# EasyEDA schematic SCH_ESP32-S3-DevKitC-1_2026-10-10.json
TITLE: ESP32-S3-WROOM-1; REV: v1.1; Date: 2022-12-12; Sheet: 1/1; Drawn By: zobject; Company: zObject
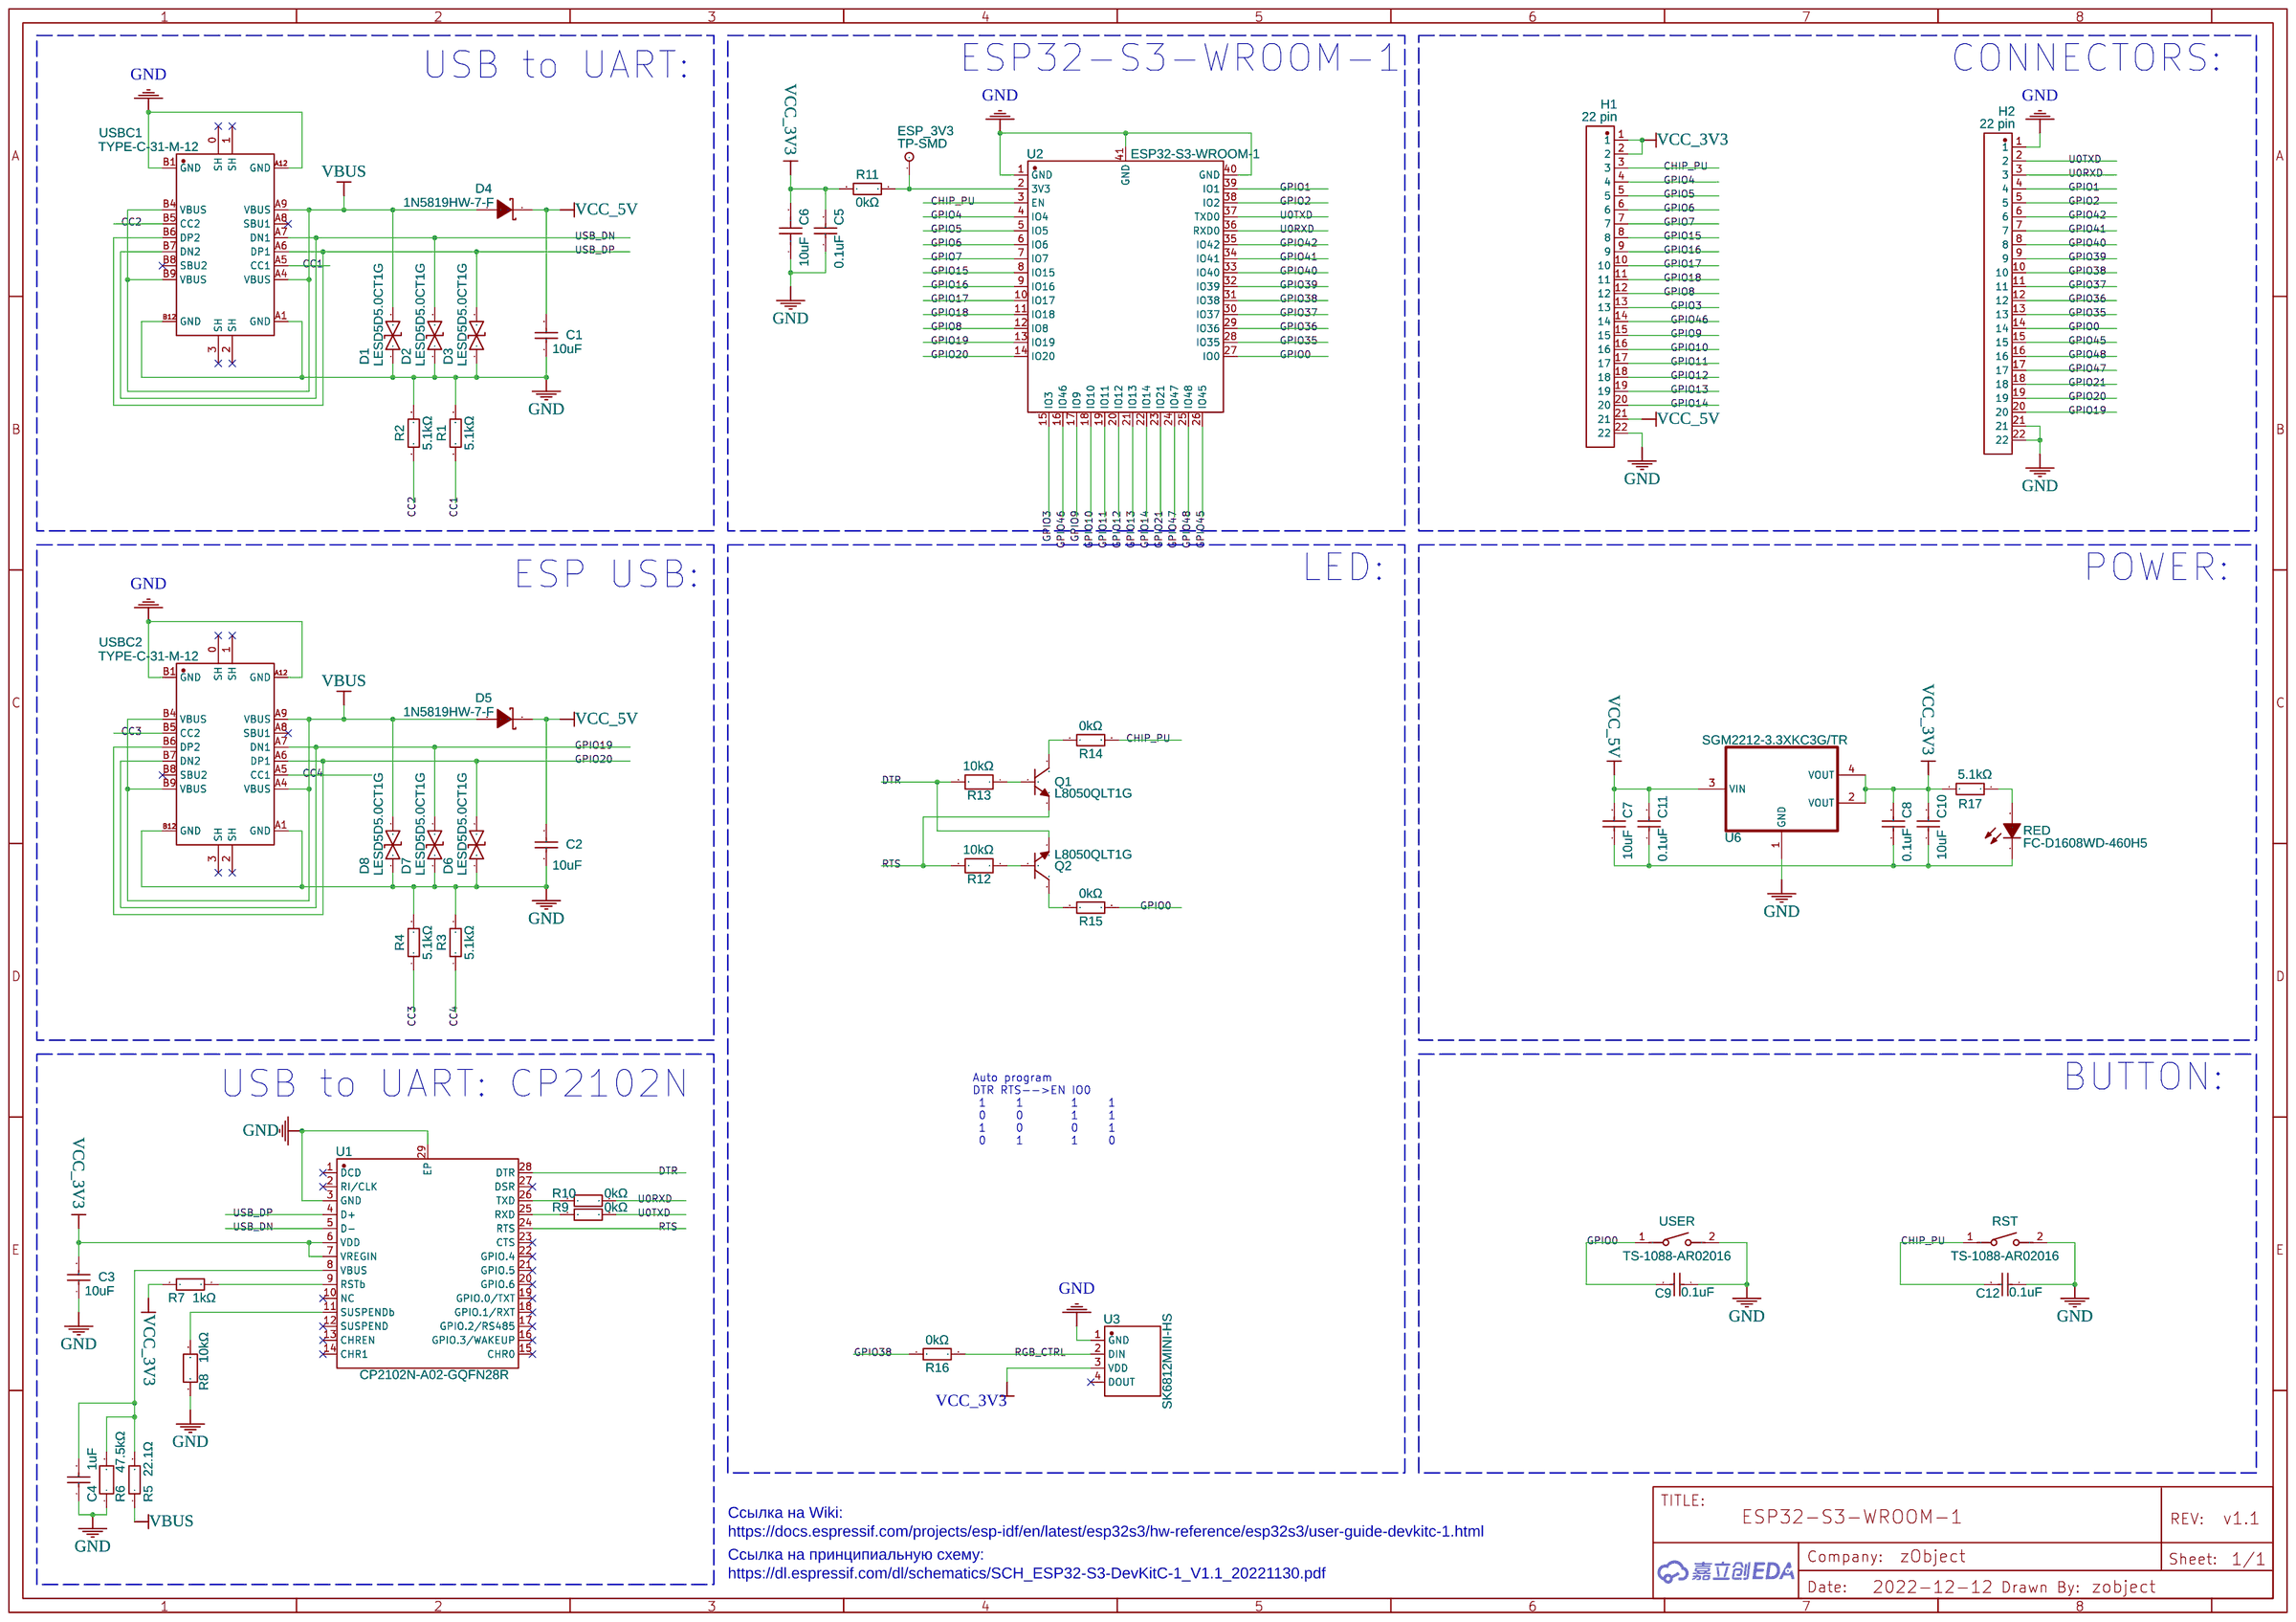
[diagram p0: schematic sheet]

## Parts
C1  10uF  [C0603]
C2  10uF  [C0603]
C3  10uF  [C0603]
C4  1uF  [C0603]
C5  0.1uF  [C0603]
C6  10uF  [C0603]
C7  10uF  [C0603]
C8  0.1uF  [C0603]
C9  0.1uF  [C0603]
C10  10uF  [C0603]
C11  0.1uF  [C0603]
C12  0.1uF  [C0603]
D1  LESD5D5.0CT1G  [SOD-523_L1.2-W0.8-LS1.6-BI]
D2  LESD5D5.0CT1G  [SOD-523_L1.2-W0.8-LS1.6-BI]
D3  LESD5D5.0CT1G  [SOD-523_L1.2-W0.8-LS1.6-BI]
D4  1N5819HW-7-F  [SOD-123_L2.8-W1.8-LS3.7-FD]
D5  1N5819HW-7-F  [SOD-123_L2.8-W1.8-LS3.7-FD]
D6  LESD5D5.0CT1G  [SOD-523_L1.2-W0.8-LS1.6-BI]
D7  LESD5D5.0CT1G  [SOD-523_L1.2-W0.8-LS1.6-BI]
D8  LESD5D5.0CT1G  [SOD-523_L1.2-W0.8-LS1.6-BI]
ESP_3V3  TP-SMD  [TP-SMD]
H1  22 pin  [HDR-TH_22P-P2.54-V-F]
H2  22 pin  [HDR-TH_22P-P2.54-V-F]
Q1  L8050QLT1G  [SOT-23-3_L2.9-W1.3-P1.90-LS2.4-BR]
Q2  L8050QLT1G  [SOT-23-3_L2.9-W1.3-P1.90-LS2.4-BR]
R1  5.1kΩ  [R0603]
R2  5.1kΩ  [R0603]
R3  5.1kΩ  [R0603]
R4  5.1kΩ  [R0603]
R5  22.1Ω  [R0603]
R6  47.5kΩ  [R0603]
R7  1kΩ  [R0603]
R8  10kΩ  [R0603]
R9  0kΩ  [R0603]
R10  0kΩ  [R0603]
R11  0kΩ  [R0603]
R12  10kΩ  [R0603]
R13  10kΩ  [R0603]
R14  0kΩ  [R0603]
R15  0kΩ  [R0603]
R16  0kΩ  [R0603]
R17  5.1kΩ  [R0603]
RED  FC-D1608WD-460H5  [LED0603-RD]
RST  TS-1088-AR02016  [SW-SMD_L4.0-W2.9-LS5.0]
U1  CP2102N-A02-GQFN28R  [QFN-28_L5.0-W5.0-P0.50-TL-EP3.3]
U2  ESP32-S3-WROOM-1  [WIRELM-SMD_ESP32-S3-WROOM-1]
U3  SK6812MINI-HS  [LED-SMD_4P-L3.5-W3.5-BR_SK6812MINI-HS]
U6  SGM2212-3.3XKC3G/TR  [SOT-223-4_L6.5-W3.5-P2.30-LS7.0-BR]
USBC1  TYPE-C-31-M-12  [USB-C_SMD-TYPE-C-31-M-12]
USBC2  TYPE-C-31-M-12  [USB-C_SMD-TYPE-C-31-M-12]
USER  TS-1088-AR02016  [SW-SMD_L4.0-W2.9-LS5.0]

## Library data of the parts
C1-C3 C7 C10 = 0603F106M160NT: Supplier: LCSC; Manufacturer: FH; Supplier Part: C48906; JLCPCB Part Class: Extended Part
C4 = C1608X5R1C105KT000N: Supplier: LCSC; Manufacturer: TDK; Supplier Part: C76611; JLCPCB Part Class: Extended Part
C5 C8 C9 C11 C12 = 0603B104K500NT: Supplier: LCSC; Manufacturer: FH(风华); Supplier Part: C30926; JLCPCB Part Class: Extended Part
C6 = LMK107BJ106MALTD: Supplier: LCSC; Manufacturer: TAIYO YUDEN; Supplier Part: C18800; JLCPCB Part Class: Extended Part
D1-D3 D6-D8 = LESD5D5.0CT1G: Supplier: LCSC; Supplier Part: C383211; Manufacturer: Leshan Radio; Contributor: LCSC; JLCPCB Part Class: Extended Part
D4 D5 = 1N5819HW-7-F: Supplier: LCSC; Manufacturer: DIODES(美台); Supplier Part: C82544; JLCPCB Part Class: Extended Part
ESP_3V3 = TP-SMD: Contributor: zobject
H1 H2 = 22 pin: Supplier: LCSC; Supplier Part: C429947; Manufacturer: JILN(锦凌); Manufacturer Part: 22850120ANG1SYA01; Contributor: zobject; JLCPCB Part Class: Extended Part
Q1 Q2 = L8050QLT1G: Supplier: LCSC; Manufacturer: LRC(乐山无线电); Supplier Part: C49581; JLCPCB Part Class: Extended Part
R1-R4 R17 = RTT035101BTP: Supplier: LCSC; Supplier Part: C312257; Manufacturer: RALEC(旺诠); Resistance (Ohms): 5.1K; Contributor: LCSC; JLCPCB Part Class: Extended Part
R5 = RCT0322R1FLF: Supplier: LCSC; Supplier Part: C177566; Manufacturer: HKR; Resistance (Ohms): 22.1; Contributor: LCSC; JLCPCB Part Class: Extended Part
R6 = ERJPB3B4752V: Supplier: LCSC; Supplier Part: C413699; Manufacturer: PANASONIC(松下); Resistance (Ohms): 47.5K; Contributor: LCSC; JLCPCB Part Class: Extended Part
R7 R9-R11 R14-R16 = RN73H1JTTD1001B25: Supplier: LCSC; Supplier Part: C186186; Manufacturer: KOA; Resistance (Ohms): 1K; Contributor: LCSC; JLCPCB Part Class: Extended Part
R8 R12 R13 = CR-03JA7---10K: Supplier: LCSC; Supplier Part: C465463; Manufacturer: Viking(光颉); Resistance (Ohms): 10K; Contributor: LCSC; JLCPCB Part Class: Extended Part
RED = FC-D1608WD-460H5: Supplier: LCSC; Manufacturer: 国星光电; Manufacturer Part: NCD0603W1; Supplier Part: C84265; JLCPCB Part Class: Extended Part
RST USER = TS-1088-AR02016: Supplier: LCSC; Supplier Part: C720477; Manufacturer: XUNPU(讯普); Contributor: LCSC; JLCPCB Part Class: Extended Part
U1 = CP2102N-A02-GQFN28R: Supplier: LCSC; Supplier Part: C964632; Manufacturer: SILICON LABS(芯科); Contributor: LCSC; JLCPCB Part Class: Extended Part
U2 = ESP32-S3-WROOM-1(N8R8): Supplier: LCSC; Supplier Part: C2913201; Manufacturer: ESPRESSIF(乐鑫); Contributor: LCSC; JLCPCB Part Class: Extended Part
U3 = SK6812MINI-HS: Supplier: LCSC; Supplier Part: C2922787; Manufacturer: null; JLCPCB Part Class: Extended Part; Contributor: LCSC
U6 = SGM2212-3.3XKC3G/TR: Supplier: LCSC; Supplier Part: C9900018517; Manufacturer: null; JLCPCB Part Class: Extended Part; Contributor: lcsc
USBC1 USBC2 = TYPE-C-31-M-12: Supplier: LCSC; Supplier Part: C165948; Manufacturer: 韩国韩荣; Contributor: LCSC; JLCPCB Part Class: Extended Part

## Nets
GND: C1.1 C2.1 C3.1 C4.1 C5.1 C6.1 C7.1 C8.1 C9.1 C10.1 C11.1 C12.1 D1.1 D2.1 D3.1 D6.1 D7.1 D8.1 H1.22 H2.1 H2.21 H2.22 R1.2 R2.2 R3.2 R4.2 R6.1 R8.1 RED.1(-) RST.2 U1.3(GND) U1.29(EP) U2.1(GND) U2.40(GND) U2.41(GND) U3.1(GND) U6.1(GND) USBC1.A1(GND) USBC1.A12(GND) USBC1.B1(GND) USBC1.B12(GND) USBC2.A1(GND) USBC2.A12(GND) USBC2.B1(GND) USBC2.B12(GND) USER.2
VBUS: D1.2 D4.1(A) D5.1(A) D8.2 R5.1 USBC1.A4(VBUS) USBC1.A9(VBUS) USBC1.B4(VBUS) USBC1.B9(VBUS) USBC2.A4(VBUS) USBC2.A9(VBUS) USBC2.B4(VBUS) USBC2.B9(VBUS)
VCC_3V3: C3.2 C5.2 C6.2 C8.2 C10.2 H1.1 H1.2 R7.1 R11.1 R17.2 U1.6(VDD) U1.7(VREGIN) U3.3(VDD) U6.2(VOUT) U6.4(VOUT)
VCC_5V: C1.2 C2.2 C7.2 C11.2 D4.2(K) D5.2(K) H1.21 U6.3(VIN)
CC1: R1.1 USBC1.A5(CC1)
CC2: R2.1 USBC1.B5(CC2)
CC3: R4.1 USBC2.B5(CC2)
CC4: R3.1 USBC2.A5(CC1)
CHIP_PU: C12.2 H1.3 R14.2 RST.1 U2.3(EN)
DTR: Q2.2(E) R13.2 U1.28(DTR)
GPIO0: C9.2 H2.14 R15.2 U2.27(IO0) USER.1
GPIO1: H2.4 U2.39(IO1)
GPIO2: H2.5 U2.38(IO2)
GPIO3: H1.13 U2.15(IO3)
GPIO4: H1.4 U2.4(IO4)
GPIO5: H1.5 U2.5(IO5)
GPIO6: H1.6 U2.6(IO6)
GPIO7: H1.7 U2.7(IO7)
GPIO8: H1.12 U2.12(IO8)
GPIO9: H1.15 U2.17(IO9)
GPIO10: H1.16 U2.18(IO10)
GPIO11: H1.17 U2.19(IO11)
GPIO12: H1.18 U2.20(IO12)
GPIO13: H1.19 U2.21(IO13)
GPIO14: H1.20 U2.22(IO14)
GPIO15: H1.8 U2.8(IO15)
GPIO16: H1.9 U2.9(IO16)
GPIO17: H1.10 U2.10(IO17)
GPIO18: H1.11 U2.11(IO18)
GPIO19: D7.2 H2.20 U2.13(IO19) USBC2.A7(DN1) USBC2.B7(DN2)
GPIO20: D6.2 H2.19 U2.14(IO20) USBC2.A6(DP1) USBC2.B6(DP2)
GPIO21: H2.18 U2.23(IO21)
GPIO35: H2.13 U2.28(IO35)
GPIO36: H2.12 U2.29(IO36)
GPIO37: H2.11 U2.30(IO37)
GPIO38: H2.10 R16.1 U2.31(IO38)
GPIO39: H2.9 U2.32(IO39)
GPIO40: H2.8 U2.33(IO40)
GPIO41: H2.7 U2.34(IO41)
GPIO42: H2.6 U2.35(IO42)
GPIO45: H2.15 U2.26(IO45)
GPIO46: H1.14 U2.16(IO46)
GPIO47: H2.17 U2.24(IO47)
GPIO48: H2.16 U2.25(IO48)
RGB_CTRL: R16.2 U3.2(DIN)
RTS: Q1.2(E) R12.2 U1.24(RTS)
U0RXD: H2.3 R10.2 U2.36(RXD0)
U0TXD: H2.2 R9.2 U2.37(TXD0)
USB_DN: D2.2 U1.5(D-) USBC1.A7(DN1) USBC1.B7(DN2)
USB_DP: D3.2 U1.4(D+) USBC1.A6(DP1) USBC1.B6(DP2)
Net-(C4-2): C4.2 R5.2 R6.2 U1.8(VBUS)
Net-(ESP_3V3-1): ESP_3V3.1 R11.2 U2.2(3V3)
Net-(Q1-1): Q1.1(B) R13.1
Net-(Q1-3): Q1.3(C) R14.1
Net-(Q2-1): Q2.1(B) R12.1
Net-(Q2-3): Q2.3(C) R15.1
Net-(R7-2): R7.2 U1.9(RSTb)
Net-(R8-2): R8.2 U1.11(SUSPENDb)
Net-(R9-1): R9.1 U1.25(RXD)
Net-(R10-1): R10.1 U1.26(TXD)
Net-(R17-1): R17.1 RED.2(+)

Not connected (* = marked no-connect by the designer): U1 1(DCD)* 2(RI/CLK)* 10(NC)* 12(SUSPEND)* 13(CHREN)* 14(CHR1)* 15(CHR0)* 16(GPIO.3/WAKEUP)* 17(GPIO.2/RS485)* 18(GPIO.1/RXT)* 19(GPIO.0/TXT)* 20(GPIO.6)* 21(GPIO.5)* 22(GPIO.4)* 23(CTS)* 27(DSR)*; U3 4(DOUT)*; USBC1 0(SH)* 1(SH)* 2(SH)* 3(SH)* A8(SBU1)* B8(SBU2)*; USBC2 0(SH)* 1(SH)* 2(SH)* 3(SH)* A8(SBU1)* B8(SBU2)*

## Notes on the sheet
- ESP32-S3-WROOM-1
- CONNECTORS:
- USB to UART:
- LED:
- POWER:
- ESP USB:
- USB to UART: CP2102N
- BUTTON:
- Auto program
  DTR RTS-->EN IO0
   1     1        1     1
   0     0        1     1
   1     0        0     1
   0     1        1     0
- Ссылка на Wiki:
  https://docs.espressif.com/projects/esp-idf/en/latest/esp32s3/hw-reference/esp32s3/user-guide-devkitc-1.html
- Ссылка на принципиальную схему:
  https://dl.espressif.com/dl/schematics/SCH_ESP32-S3-DevKitC-1_V1.1_20221130.pdf
